# Altium schematic sheet ControllerV0.SchDoc (part 1 of 3)
size 431 x 241 mm; SheetNumber: 1; SheetTotal: 1
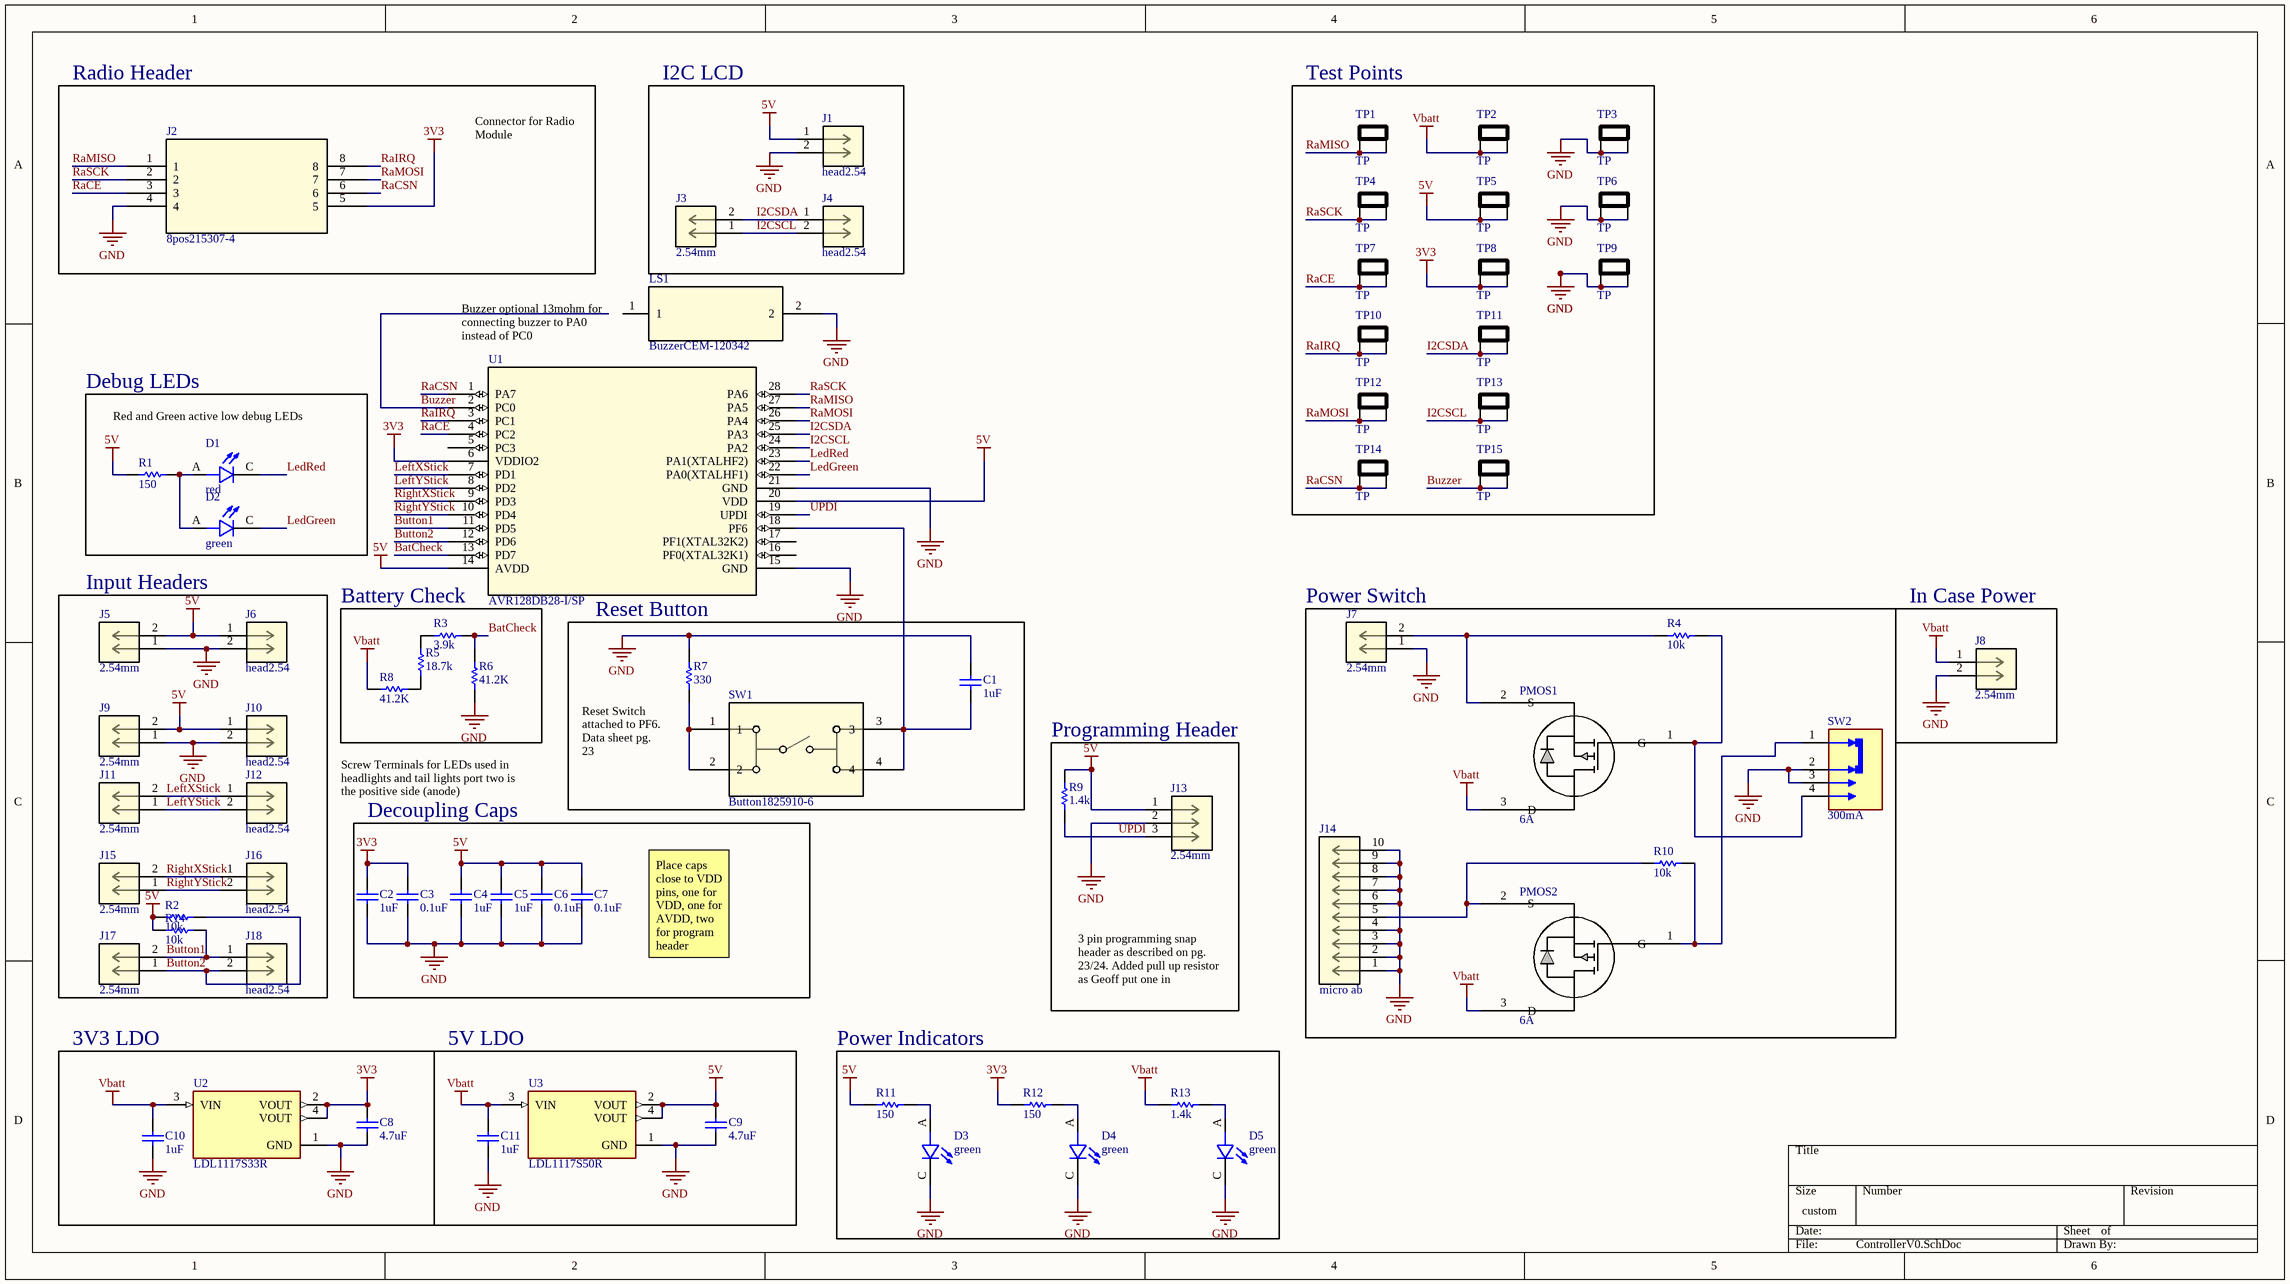
[diagram p0: ControllerV0.SchDoc]

## Parts
C1  1uF  [RES 0805]
C2  1uF  [RES 0805]
C3  0.1uF  [RES 0805]
C4  1uF  [RES 0805]
C5  1uF  [RES 0805]
C6  0.1uF  [RES 0805]
C7  0.1uF  [RES 0805]
C8  4.7uF  [RES 0805]
C9  4.7uF  [RES 0805]
C10  1uF  [RES 0805]
C11  1uF  [RES 0805]
D1  red  [0603LED]
D2  green  [0603LED]
D3  green  [0603LED]
D4  green  [0603LED]
D5  green  [0603LED]
J1  head2.54  [Head 2.54mm 2pos]
J2  8pos215307-4  [215307-4]
J3  2.54mm  [CON screw 2pos 2.54mm]
J4  head2.54  [Head 2.54mm 2pos]
J5  2.54mm  [CON screw 2pos 2.54mm]
J6  head2.54  [Head 2.54mm 2pos]
J7  2.54mm  [CON screw 2pos 2.54mm]
J8  2.54mm  [CON screw 2pos 2.54mm]
J9  2.54mm  [CON screw 2pos 2.54mm]
J10  head2.54  [Head 2.54mm 2pos]
J11  2.54mm  [CON screw 2pos 2.54mm]
J12  head2.54  [Head 2.54mm 2pos]
J13  2.54mm  [HEAD 2.54mm 3pos]
J14  micro ab  [USB micro ab 0475900001]
J15  2.54mm  [CON screw 2pos 2.54mm]
J16  head2.54  [Head 2.54mm 2pos]
J17  2.54mm  [CON screw 2pos 2.54mm]
J18  head2.54  [Head 2.54mm 2pos]
LS1  BuzzerCEM-120342  [CEM-1203(42)]
PMOS1  6A  [SOT-23F MOS PMOS 30V 6A]
PMOS2  6A  [SOT-23F MOS PMOS 30V 6A]
R1  150  [RES 0805]
R2  10k  [RES 0805]
R3  3.9k  [RES 0805]
R4  10k  [RES 0805]
R5  18.7k  [RES 0805]
R6  41.2K  [RES 0805]
R7  330  [RES 0805]
R8  41.2K  [RES 0805]
R9  1.4k  [RES 0805]
R10  10k  [RES 0805]
R11  150  [RES 0805]
R12  150  [RES 0805]
R13  1.4k  [RES 0805]
R14  10k  [RES 0805]
SW1  Button1825910-6  [Button1825910-6]
SW2  300mA  [Switch On-On-On 300mA SLW-1277545-2A-RA-S-D]
TP1  TP  [RES 0805]
TP2  TP  [RES 0805]
TP3  TP  [RES 0805]
TP4  TP  [RES 0805]
TP5  TP  [RES 0805]
TP6  TP  [RES 0805]
TP7  TP  [RES 0805]
TP8  TP  [RES 0805]
TP9  TP  [RES 0805]
TP10  TP  [RES 0805]
TP11  TP  [RES 0805]
TP12  TP  [RES 0805]
TP13  TP  [RES 0805]
TP14  TP  [RES 0805]
TP15  TP  [RES 0805]
U1  AVR128DB28-I/SP  [AVR128DB28-ISP]
U2  LDL1117S33R  [SOT230P700X180-4N]
U3  LDL1117S50R  [SOT230P700X180-4N]

## Blocks framed on the sheet
Radio Header: J2
I2C LCD: J1 J3 J4
Test Points: TP1-TP15
Debug LEDs: D1 D2 R1
Input Headers: J5 J6 J9-J12 J15-J18 R2 R14
Battery Check: R3 R5 R6 R8
Reset Button: C1 R7 SW1
Power Switch: J7 J14 PMOS1 PMOS2 R4 R10 SW2
Programming Header: J13 R9
Decoupling Caps: C2-C7
Power Indicators: D3-D5 R11-R13

## Nets
3V3: C2.2 C3.2 C8.2 J2.5 R12.1 TP8.1 TP8.2 U1.6(VDDIO2) U2.2(VOUT) U2.4(VOUT)
5V: C4.2 C5.1 C6.2 C7.2 C9.2 J1.1 J5.2 J6.1 J9.2 J10.1 J13.1 R1.1 R2.2 R9.2 R11.1 R14.2 TP5.1 TP5.2 U1.14(AVDD) U1.20(VDD) U3.2(VOUT) U3.4(VOUT)
GND: C1.2 C2.1 C3.1 C4.1 C5.2 C6.1 C7.1 C8.1 C9.1 C10.1 C11.1 D3.C D4.C D5.C J1.2 J2.4 J5.1 J6.2 J7.1 J8.2 J9.1 J10.2 J13.2 J14.1(VBUS) J14.2(D-) J14.3(D+) J14.4(ID) J14.6(SHIELD) J14.7(SHIELD) J14.8(SHIELD) J14.9(SHIELD) J14.10(SHIELD) LS1.2 R6.1 R7.2 SW2.2 SW2.3 TP3.1 TP3.2 TP6.1 TP6.2 TP9.1 TP9.2 U1.15(GND) U1.21(GND) U2.1(GND) U3.1(GND)
Vbatt: C10.2 C11.2 J8.1 PMOS1.3(D) PMOS2.3(D) R8.2 R13.1 TP2.1 TP2.2 U2.3(VIN) U3.3(VIN)
BatCheck: R3.2 R6.2 U1.13(PD7)
Button1: J17.2 J18.1 R14.1 U1.11(PD5)
Button2: J17.1 J18.2 R2.1 U1.12(PD6)
Buzzer: LS1.1 TP15.1 TP15.2 U1.2(PC0)
I2CSCL: J3.1 J4.2 TP13.1 TP13.2 U1.24(PA2)
I2CSDA: J3.2 J4.1 TP11.1 TP11.2 U1.25(PA3)
LedGreen: D2.C U1.22(PA0(XTALHF1))
LedRed: D1.C U1.23(PA1(XTALHF2))
LeftXStick: J11.2 J12.1 U1.7(PD1)
LeftYStick: J11.1 J12.2 U1.8(PD2)
RaCE: J2.3 TP7.1 TP7.2 U1.4(PC2)
RaCSN: J2.6 TP14.1 TP14.2 U1.1(PA7)
RaIRQ: J2.8 TP10.1 TP10.2 U1.3(PC1)
RaMISO: J2.1 TP1.1 TP1.2 U1.27(PA5)
RaMOSI: J2.7 TP12.1 TP12.2 U1.26(PA4)
RaSCK: J2.2 TP4.1 TP4.2 U1.28(PA6)
RightXStick: J15.2 J16.1 U1.9(PD3)
RightYStick: J15.1 J16.2 U1.10(PD4)
UPDI: J13.3 R9.1 U1.19(UPDI)
NetC1_1: C1.1 SW1.3 SW1.4 U1.18(PF6)
NetD1_A: D1.A D2.A R1.2
NetD3_A: D3.A R11.2
NetD4_A: D4.A R12.2
NetD5_A: D5.A R13.2
NetJ7_2: J7.2 PMOS1.2(S) R4.1
NetJ14_5: J14.5(GND) PMOS2.2(S) R10.1
NetPMOS1_1: PMOS1.1(G) R4.2 SW2.4
NetPMOS2_1: PMOS2.1(G) R10.2 SW2.1
NetR3_1: R3.1 R5.1
NetR5_2: R5.2 R8.1
NetR7_1: R7.1 SW1.1 SW1.2

Not connected (* = marked no-connect by the designer): U1 5(PC3) 16(PF0(XTAL32K1)) 17(PF1(XTAL32K2))

## Notes on the sheet
- Connector for Radio Module
- Buzzer optional 13mohm for connecting buzzer to PA0 instead of PC0
- Red and Green active low debug LEDs
- In Case Power
- Screw Terminals for LEDs used in headlights and tail lights port two is the positive side (anode)
- (near R7) Reset Switch attached to PF6. Data sheet pg. 23
- Place caps close to VDD pins, one for VDD, one for AVDD, two for program header
- 3 pin programming snap header as described on pg. 23/24. Added pull up resistor as Geoff put one in
- 3V3 LDO
- 5V LDO